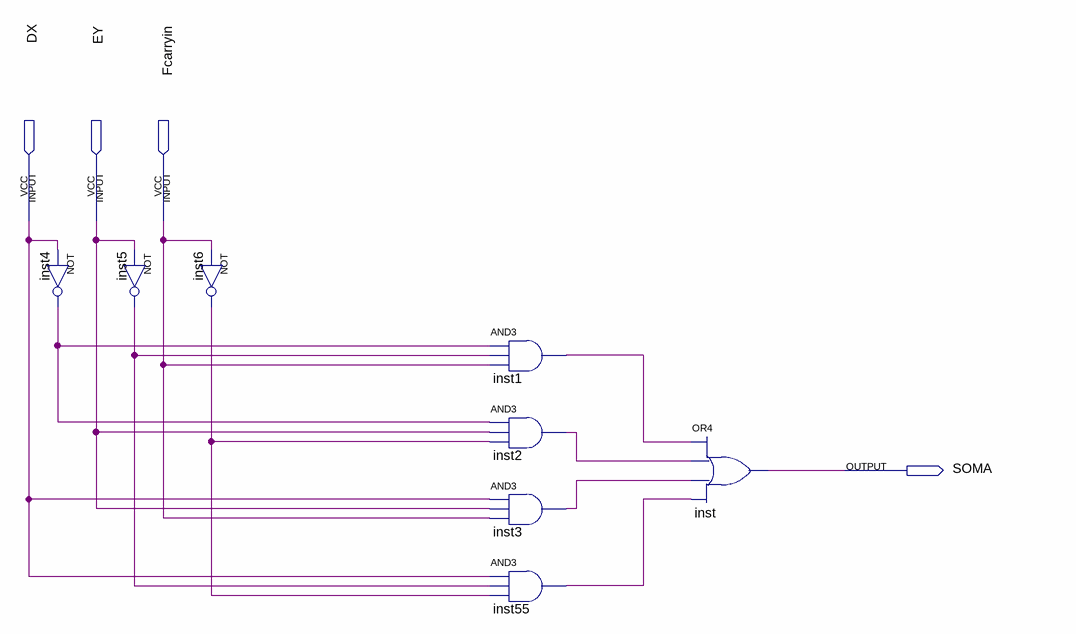
[diagram p0: schematic sheet]
// Quartus schematic soma.bdf as structural Verilog: 8 symbols, 4 pins
module soma (
  input  DX,
  input  EY,
  input  Fcarryin,
  output SOMA
);

  wire inst1_out, inst2_out, inst3_out, inst4_out, inst5_out, inst6_out, inst55_out;

  not inst4 (inst4_out, DX);
  not inst5 (inst5_out, EY);
  not inst6 (inst6_out, Fcarryin);
  and inst1 (inst1_out, inst4_out, inst5_out, Fcarryin);
  and inst2 (inst2_out, inst4_out, EY, inst6_out);
  and inst3 (inst3_out, DX, EY, Fcarryin);
  and inst55 (inst55_out, DX, inst5_out, inst6_out);
  or inst (SOMA, inst1_out, inst2_out, inst3_out, inst55_out);
endmodule
